# Altium schematic sheet Sheet2.SchDoc
size A4; SheetNumber: 1; SheetTotal: 1
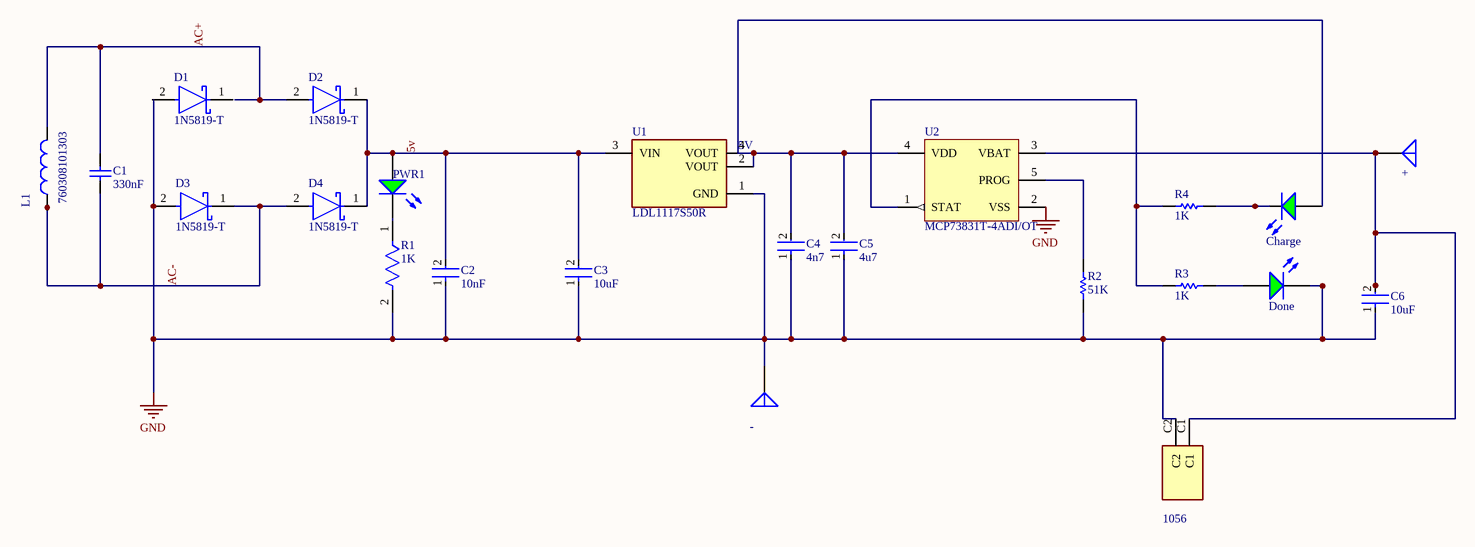
[diagram p0: Sheet2.SchDoc]

## Parts
+  Antenna  [PIN1]  (value not drawn)
-  Antenna  [PIN1]  (value not drawn)
C1  330nF  [CAPC1206(3216)170_M]
C2  10nF  [FP-RDE2M1-MFG]
C3  10uF  [FP-RDE2M1-MFG]
C4  4n7  [FP-RDE2M1-MFG]
C5  4u7  [FP-RDE2M1-MFG]
C6  10uF  [FP-RDE2M1-MFG]
Charge  WP7113SGD  [KING-WP7113SGD_V]  (value not drawn)
D1  1N5819-T  [FP-DO-41_Plastic-MFG]
D2  1N5819-T  [FP-DO-41_Plastic-MFG]
D3  1N5819-T  [FP-DO-41_Plastic-MFG]
D4  1N5819-T  [FP-DO-41_Plastic-MFG]
Done  WP7113SGD  [KING-WP7113SGD_V]  (value not drawn)
L1  760308101303  [760308101303]
LIR?  1056  [1056]
PWR1  WP7113SGD  [KING-WP7113SGD_V]  (value not drawn)
R1  1K  [FP-HCJ1206-MFG]
R2  value 51K  [AXIAL-0.3]
R3  value 1K  [AXIAL-0.3]
R4  value 1K  [AXIAL-0.3]
U1  LDL1117S50R  [FP-SOT-223-0046067_14-MFG]
U2  MCP73831T-4ADI/OT  [SOT-23-OT5_N]

## Nets
GND: -.1(A) C2.1 C3.1 C4.1 C5.1 C6.1 D3.2(A) Done.2(K) LIR?.C2 R1.2 R2.1 U1.1(GND) U2.2(VSS)
5v: C2.2 C3.2 D2.1(C) D4.1(C) PWR1.1(A) U1.3(VIN)
AC+: C1.1 D2.2(A) L1.2
AC-: C1.2 D3.1(C) D4.2(A) L1.1
Net+_1: +.1(A) C6.2 LIR?.C1 U2.3(VBAT)
NetC4_2: C4.2 C5.2 Charge.1(A) U1.2(VOUT) U1.4(VOUT) U2.4(VDD)
NetCharge_2: Charge.2(K) R4.1
NetDone_1: Done.1(A) R3.1
NetPWR1_2: PWR1.2(K) R1.1
NetR2_2: R2.2 U2.5(PROG)
NetR3_2: R3.2 R4.2 U2.1(STAT)

Not connected (* = marked no-connect by the designer): D1 1(C) 2(A)

## Notes on the sheet
- (near U1) 5V

## Library data of the parts
+ - = Antenna: Generic Antenna; Published: 24-Mar-1999; LatestRevisionDate: 17-Jul-2002; LatestRevisionNote: Re-released for DXP Platform.; PackageReference: PIN1; Publisher: Altium Limited
C1 = CMP-1037-03299-1: CAP 6.8nF 50V ±10% 1206 (3216 Metric) Thickness 1.7mm SMD; Tolerance: Â±10%; Case-EIA: 1206; Case-Metric: 3216; Value: 6.8nF; Technology: SMT; Rated Voltage: 50 V; Max Thickness: 1.7 mm
C2-C6 = CMP-06035-028300-1: Ceramic Capacitor 10nF ±10% 630V X7R Radial; Lead Diameter: 0.5mm; Lead/Base Style: Formed Leads; Width: 4mm; Resistor Type: Ceramic; Lead Free: Lead Free; Case/Package: Radial; Voltage Rating: 630V; Dielectric: X7R; Mount: Through Hole; Capacitance: 10nF; Voltage Rating (DC): 630V; Length: 0.217inch; Max Operating Temperature: 125°C; Min Operating Temperature: -55°C; Packaging: Tape and Reel; Height: 4mm; Package Quantity: 2000; Termination: Radial; Lead Pitch: 0.197inch; Tolerance: 10%; Height - Seated (Max): 0.236inch
Charge Done PWR1 = CMP-2100-03698-1: LED Green, 62.5 mW, 25 mA, -40 to 85 degC, 2-Pin THD, RoHS, Bulk; Manufacturer: Kingbright; Viewing Angle: 30degrees; Lens Style: Tinted; Test Current: 20mA; Forward Voltage: 2.2V; Wavelength: 568nm; Luminous Intensity: 40mcd; Package Reference: WP7113SGD; Colour: Green; Lead Free: LeadFree; Packaging: Bulk; RoHSCompliant: true; Package Quantity: 1000; Illumination Colour: Green; Case/Package: Radial; Datasheet URL: http://www.kingbrightusa.com/images/catalog/SPEC/WP7113SGD.pdf; Dominant Wavelength: 568nm; Datasheet Version: Rev. 6B, 01/2015; Package Description: 2-Pin Through Hole Device, Dia 5.9 mm, Body Length 8.6 mm; Height: 8.6mm
D1-D4 = CMP-12790-000042-1: DIODE SCHOTTKY 40V 1A DO41; Manufacturer: Diodes Inc.; Max Surge Forward Current: 25A; Capacitance: 110 pF; Max Junction Temp: +125°C; Peak Reverse Current: 1mA; Value: 110 pF; Temperature Range Low: -65°C; Footprint Url: https://www.diodes.com/assets/Package-Files/DO-41-Plastic.pdf; Digikey Description: DIODE SCHOTTKY 40V 1A DO41; Category: Diode; Mouser Description: Schottky Diodes & Rectifiers Vr/40V Io/1A T/R; Device Class L2: Diodes; Temperature Range High: +125°C; RoHS: TRUE; Device Class L3: Schottky Diodes; ComponentLink2Description: Datasheet; Temperature: -65°C to +125°C; Reverse Voltage: 40V; Height: 2.72mm; ComponentLink2URL: https://www.diodes.com/assets/Datasheets/ds23001.pdf; Forward Current: 1A; Manufacturer Part Number: 1N5819-T; Lead Free: Yes; Device Class L1: Discrete Semiconductors; Max Repetitive Reverse Voltage: 40V; Ipc Land Pattern Name: DIOPA1091W105L521D272; Automotive: No; Package: DO-41 (Plastic); Octopart: https://octopart.com/1n5819-t-diodes+inc.-55389586
L1 = CMP-03913-52738428-3: WE-WPCC Wireless Power Charging Coil; Saturation Current: 3A; Q Factor: 25; Inductance: 47µH; Current Rating: 1.5A; Logic Function: Receiver; Inductance Tolerance: 10%; Self Resonant Frequency: 8MHz; DC Resistance (DCR): 460mΩ; Resistance: 500mΩ; RoHS: Compliant; Number of Pins: 2; Height: 1.3mm; Length: 25mm; Tolerance: 10%; REACH SVHC: Unknown; Min Operating Temperature: -20°C; Diameter: 26.3mm; Max Operating Temperature: 105°C; Width: 25mm
LIR? = 1056: Hardware; Manufacturer_Name: Keystone Electronics; Datasheet Link: https://www.keyelco.com/product.cfm/product_id/715; Height: 4.24mm; Manufacturer_Part_Number: 1056; Mouser Part Number: 534-1056; Mouser Price/Stock: https://www.mouser.co.uk/ProductDetail/Keystone-Electronics/1056?qs=sZfk%252BfAlGe4w00bCJntjFg%3D%3D
R1 = CMP-26527-002752-1: RES 0 OHM JUMPER 3/4W 1206; Resistance: 0mR; Radiation Hardening: No; Features: Automotive AEC-Q200; RoHS Compliant: Yes; Height: 0.026inch; Case Code (Metric): 3216; Min Operating Temperature: -55°C; Number of Terminations: 2; Mount: Surface Mount; Case/Package: 1206; Termination: Wraparound; Length: 0.122inch; Packaging: Tape and Reel; Max Operating Temperature: 155°C; Case Code (Imperial): 1206; Package Quantity: 5000; Width: 0.061inch
R2-R4 = Res1: Resistor; Published: 8-Jun-2000; LatestRevisionDate: 17-Jul-2002; LatestRevisionNote: Re-released for DXP Platform.; PackageReference: AXIAL-0.3; Publisher: Altium Limited; PackageDescription: Axial Device, Thru-Hole; 2 Leads; 0.3 in Pin Spacing
U1 = CMP-12153-000005-1: IC REG LINEAR 5V 1.2A SOT223; Manufacturer: STMicroelectronics; Standoff Height: 0.02mm; Min Supply Voltage: 2.6V; Nominal Supply Current: 250uA; Max Junction Temp: +150°C; Accuracy Percentage: 2%; Output Type: Fixed; Max Supply Voltage: 18V; Output Current: 2A; Number Of Outputs: 1; Dropout Voltage: 350mV; ComponentLink2Description: Datasheet; Temperature Range High: +125°C; Manufacturer Part Number: LDL1117S50R; Digikey Description: IC REG LINEAR 5V 1.2A SOT223; Device Class L2: Power Management ICs; RoHS: TRUE; Temperature: -40°C to +125°C; Device Class L3: Voltage Regulators - Linear; Automotive: No; Mouser Description: LDL1117 Series 1.2 A 5 V High PSRR LDO Linear Voltage Regulator - SOT-223; Package: SOT-223-0046067_14; ComponentLink2URL: https://www.st.com/content/ccc/resource/technical/document/datasheet/group3/0e/5a/00/ca/10/1a/4f/a5/DM00366442/files/DM00366442.pdf/jcr:content/translations/en.DM00366442.pdf; Output Voltage: 5V; Octopart: https://octopart.com/ldl1117s50r-stmicroelectronics-81876164; Category: IC; Device Class L1: Integrated Circuits (ICs); Temperature Range Low: -40°C; Height: 1.9mm; Lead Free: Yes
U2 = CMP-0133-00137-1: Miniature Single-Cell, Fully Integrated Li-Ion, Li-Polymer Charge Management Controller, 4.4V, 5-Pin SOT-23, Industrial Temperature, Tape and Reel; PackageDescription: 5-Lead Plastic Small Outline Transistor (OT) [SOT-23]; DatasheetVersion: revE, Sep-2008; PackageReference: SOT-23-OT5; PackageVersion: revBB, Aug-2009; Code_IPC: SOT23-5